# Altium schematic sheet Relay.SchDoc
size A4; SheetNumber: 11; SheetTotal: 11
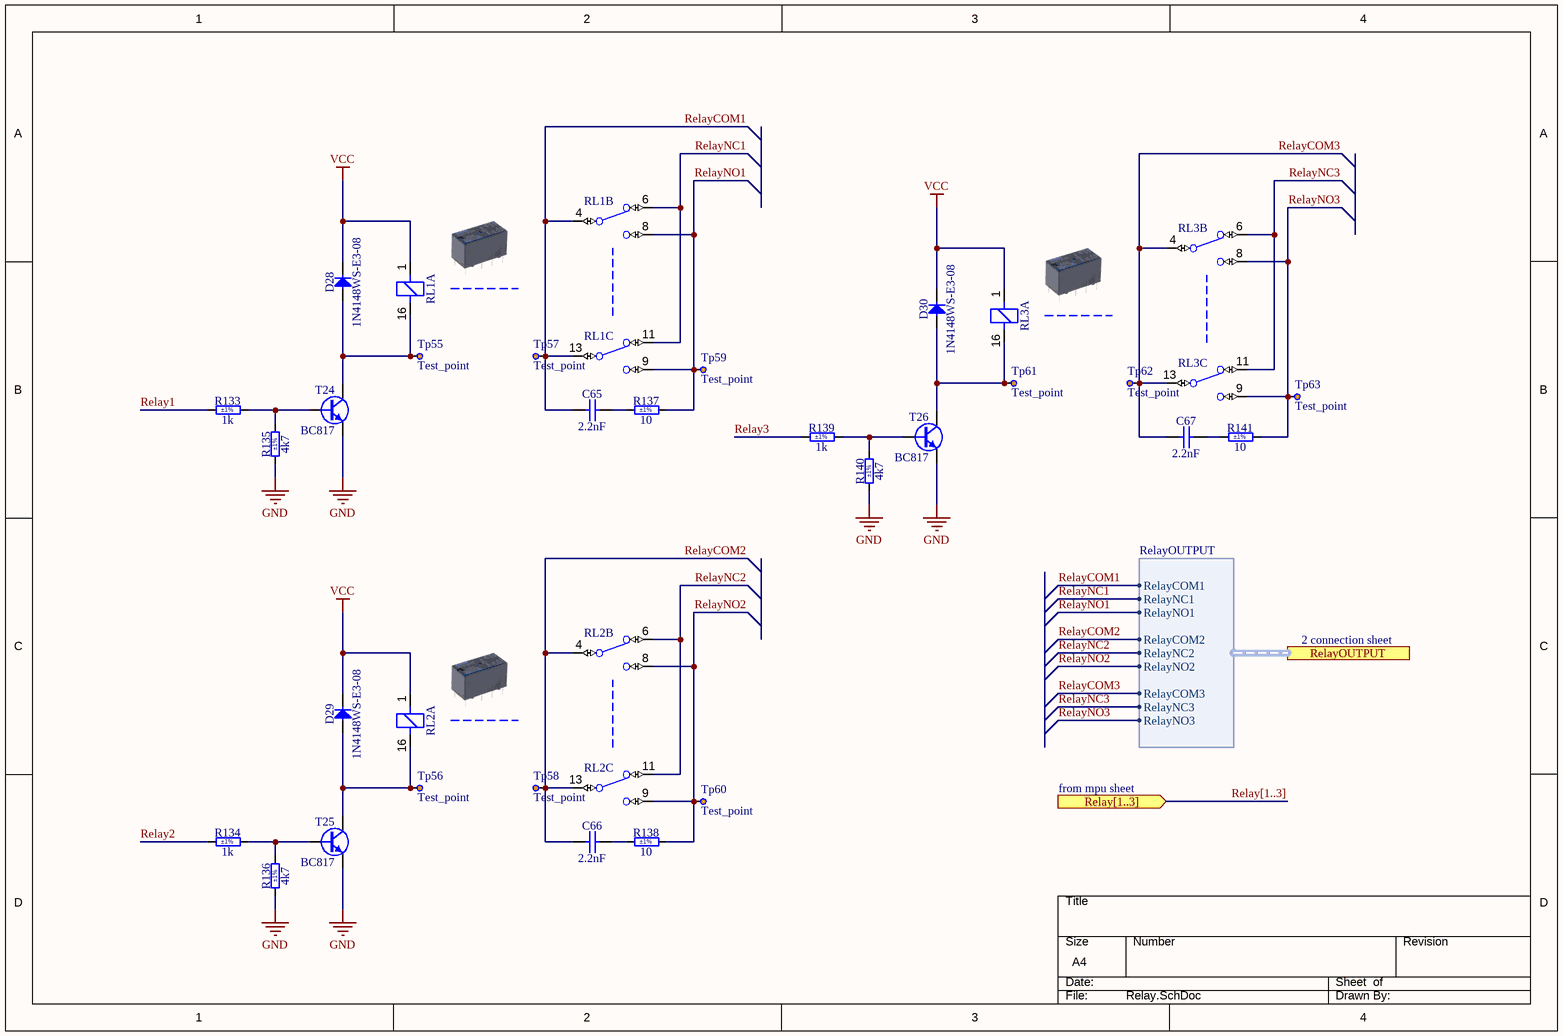
[diagram p0: Relay.SchDoc]

## Parts
C65  2.2nF  [CAPRB_MURATA_DE2E3KY222MA2BM01F]
C66  2.2nF  [CAPRB_MURATA_DE2E3KY222MA2BM01F]
C67  2.2nF  [CAPRB_MURATA_DE2E3KY222MA2BM01F]
D28  1N4148WS-E3-08  [SOD2713X115N]
D29  1N4148WS-E3-08  [SOD2713X115N]
D30  1N4148WS-E3-08  [SOD2713X115N]
R133  1k  Tolerance: ±1%  [RESC1608X55N]
R134  1k  Tolerance: ±1%  [RESC1608X55N]
R135  4k7  Tolerance: ±1%  [RESC1608X55N]
R136  4k7  Tolerance: ±1%  [RESC1608X55N]
R137  10  Tolerance: ±1%  [RESC3216X65N]
R138  10  Tolerance: ±1%  [RESC3216X65N]
R139  1k  Tolerance: ±1%  [RESC1608X55N]
R140  4k7  Tolerance: ±1%  [RESC1608X55N]
R141  10  Tolerance: ±1%  [RESC3216X65N]
RL1  REL_OMRON_G5V-2  [REL_OMRON_G5V-2]  (value not drawn)  (parts A,B,C of 3)
RL2  REL_OMRON_G5V-2  [REL_OMRON_G5V-2]  (value not drawn)  (parts A,B,C of 3)
RL3  REL_OMRON_G5V-2  [REL_OMRON_G5V-2]  (value not drawn)  (parts A,B,C of 3)
T24  BC817  [SOT95P230X110-3N]
T25  BC817  [SOT95P230X110-3N]
T26  BC817  [SOT95P230X110-3N]
Tp55  Test_point  [TP_C40]
Tp56  Test_point  [TP_C40]
Tp57  Test_point  [TP_C40]
Tp58  Test_point  [TP_C40]
Tp59  Test_point  [TP_C40]
Tp60  Test_point  [TP_C40]
Tp61  Test_point  [TP_C40]
Tp62  Test_point  [TP_C40]
Tp63  Test_point  [TP_C40]

## Ports
Relay[1..3] (in), RelayOUTPUT (harness RelayOUTPUT)

## Harnesses
RelayOUTPUT: RelayCOM1, RelayNC1, RelayNO1, RelayCOM2, RelayNC2, RelayNO2, RelayCOM3, RelayNC3, RelayNO3

## Nets
GND: R135.1 R136.1 R140.1 T24.2(E) T25.2(E) T26.2(E)
VCC: D28.1(C) D29.1(C) D30.1(C) RL1.1 RL2.1 RL3.1
Relay1: R133.1
Relay2: R134.1
Relay3: R139.1
RelayCOM1: C65.1 RL1.4(C) RL1.13(C) Tp57.1 ; port RelayOUTPUT.RelayCOM1
RelayCOM2: C66.1 RL2.4(C) RL2.13(C) Tp58.1 ; port RelayOUTPUT.RelayCOM2
RelayCOM3: C67.1 RL3.4(C) RL3.13(C) Tp62.1 ; port RelayOUTPUT.RelayCOM3
RelayNC1: RL1.6(NC) RL1.11(NC) ; port RelayOUTPUT.RelayNC1
RelayNC2: RL2.6(NC) RL2.11(NC) ; port RelayOUTPUT.RelayNC2
RelayNC3: RL3.6(NC) RL3.11(NC) ; port RelayOUTPUT.RelayNC3
RelayNO1: R137.2 RL1.8(NO) RL1.9(NO) Tp59.1 ; port RelayOUTPUT.RelayNO1
RelayNO2: R138.2 RL2.8(NO) RL2.9(NO) Tp60.1 ; port RelayOUTPUT.RelayNO2
RelayNO3: R141.2 RL3.8(NO) RL3.9(NO) Tp63.1 ; port RelayOUTPUT.RelayNO3
NetC65_2: C65.2 R137.1
NetC66_2: C66.2 R138.1
NetC67_2: C67.2 R141.1
NetD28_2: D28.2(A) RL1.16 T24.3(C) Tp55.1
NetD29_2: D29.2(A) RL2.16 T25.3(C) Tp56.1
NetD30_2: D30.2(A) RL3.16 T26.3(C) Tp61.1
NetR133_2: R133.2 R135.2 T24.1(B)
NetR134_2: R134.2 R136.2 T25.1(B)
NetR139_2: R139.2 R140.2 T26.1(B)

## Buses and harness runs
bus Relay[1..3] = port Relay[1..3]

## Notes on the sheet
- 2 connection sheet
- from mpu sheet

## Library data of the parts
C65-C67 = CCR_2.2NF_250V_20%_MURATA_DE2E3KY222MA2BM01F: Non-polarised capacitor; Part Description: Disc Ceramic Capacitors for General Purpose, Type KY (Basic Insulation) - Class X1 Y2; Manufacturer: MURATA; Voltage: 250VAC; Tolerance: ±20%; Part Number: CCR_2.2NF_250V_20%_MURATA_DE2E3KY222MA2BM01F; Component Kind: Standard; Component Type: Standard; Pin Count: 2; Value: 2.2nF; Status: None; Manufacturer Part Number: DE2E3KY222MA2BM01F; Case: LS5 W5 x D8; Mounted: Yes; Socket: No; SMD: No; Sense: No; ComponentHeight: 11mm; HelpURL: \\cern.ch\dfs\Applications\Altium\Datasheets\CCR_MURATA_DE2E3KY222MA2BM01F.pdf; Author: CERN DEM JLC; CreateDate: 17.09.2018; LatestRevisionDate: 17.09.2018
D28-D30 = 1N4148WS-E3-08: Diode; Part Description: Small Signal Fast Switching Diode; Manufacturer: VISHAY SEMICONDUCTORS; Voltage: 75V; Power: 150mA; PressFit: No; Bonding: No; Part Number: 1N4148WS-E3-08; Component Kind: Standard; Component Type: Standard; Device: 1N4148WS-E3-08; PackageDescription: SOD-323 Diode; 1.775mm W X 1.30mm L X 1.15mm H Body, IPC Medium Density; Manufacturer Part Number: 1N4148WS-E3-08; Pin Count: 3; Case: SOD-323; Mounted: Yes; Socket: No; SMD: Yes; Sense: No; ComponentHeight: 1.15mm; HelpURL: \\cern.ch\dfs\Applications\Altium\Datasheets\1N4148WS-E3-08.pdf; Author: CERN DEM JLC; CreateDate: 16.12.2013; LatestRevisionDate: 16.12.2013
R133 R134 R139 = R0603_1K_1%_0.1W_100PPM: Resistor - 1%; Part Description: General Purpose Thick Film Chip Resistor; Manufacturer: GENERIC; Manufacturer1 Part Number: NRC06F1001TRF; Power: 0.1W; TC: ±100ppm/°C; PressFit: No; Part Number: R0603_1K_1%_0.1W_100PPM; Component Kind: Standard; Component Type: Standard; Pin Count: 2; Value: 1k; Status: Preferred; Manufacturer Part Number: R0603_1K_1%_0.1W_100PPM; Case: 0603; Mounted: Yes; Sense: No; Socket: No; SMD: Yes; Manufacturer1 Example: NIC COMPONENT; Manufacturer1 ComponentHeight: 0.55mm; HelpURL: \\cern.ch\dfs\Applications\Altium\Datasheets\R0603_NIC_NRC.pdf; Author: CERN DEM JLC; CreateDate: 03.12.2007; LatestRevisionDate: 13.03.2008
R135 R136 R140 = R0603_4K7_1%_0.1W_100PPM: Resistor - 1%; Part Description: General Purpose Thick Film Chip Resistor; Manufacturer: GENERIC; Manufacturer1 Part Number: NRC06F4701TRF; Power: 0.1W; TC: ±100ppm/°C; PressFit: No; Part Number: R0603_4K7_1%_0.1W_100PPM; Component Kind: Standard; Component Type: Standard; Pin Count: 2; Value: 4k7; Status: Preferred; Manufacturer Part Number: R0603_4K7_1%_0.1W_100PPM; Case: 0603; Mounted: Yes; Sense: No; Socket: No; SMD: Yes; Manufacturer1 Example: NIC COMPONENT; Manufacturer1 ComponentHeight: 0.55mm; HelpURL: \\cern.ch\dfs\Applications\Altium\Datasheets\R0603_NIC_NRC.pdf; Author: CERN DEM JLC; CreateDate: 03.12.2007; LatestRevisionDate: 13.03.2008
R137 R138 R141 = R1206_10R_1%_0.25W_100PPM: Resistor - 1%; Part Description: General Purpose Thick Film Chip Resistor; Manufacturer: GENERIC; Manufacturer1 Part Number: NRC12F10R0TRF; Power: 0.25W; TC: ±100ppm/°C; PressFit: No; Part Number: R1206_10R_1%_0.25W_100PPM; Component Kind: Standard; Component Type: Standard; Pin Count: 2; Value: 10; Status: Preferred; Manufacturer Part Number: R1206_10R_1%_0.25W_100PPM; Case: 1206; Mounted: Yes; Sense: No; Socket: No; SMD: Yes; Manufacturer1 Example: NIC COMPONENT; Manufacturer1 ComponentHeight: 0.65mm; HelpURL: \\cern.ch\dfs\Applications\Altium\Datasheets\R1206_NIC_NRC.pdf; Author: CERN DEM BC; CreateDate: 14.12.2020; LatestRevisionDate: 14.12.2020
RL1-RL3 = REL_OMRON_G5V-2-H1 24VDC: Miniature Relay for Signal Circuits; Part Description: DPDT High Sensitivity Miniature Relay for Signal Circuits, G5V-2 Series; Manufacturer: OMRON ELECTRONIC; Manufacturer Part Number: G5V-2-H1 24DC; PressFit: No; Value: 24VDC; Part Number: REL_OMRON_G5V-2-H1 24VDC; Component Kind: Standard; Component Type: Standard; Pin Count: 8; PackageDescription: 8 Leads, Row Spacing 7.62mm; Body 20.5mm x 10.1mm, OMRON_G5V-2 Series; Mounted: Yes; Socket: No; SMD: No; Sense: No; Status: None; ComponentHeight: 11.5mm; HelpURL: \\cern.ch\dfs\Applications\Altium\Datasheets\REL_OMRON_G5V-2.pdf; Author: CERN DEM JLC; CreateDate: 23.09.2010; LatestRevisionDate: 23.09.2010
T24-T26 = BC817: NPN Transistor; Part Description: 45V 500mA NPN General-Purpose Transistor; Manufacturer: NXP SEMICONDUCTORS; PressFit: No; Bonding: No; Part Number: BC817; Component Kind: Standard; Component Type: Standard; Device: BC817; PackageDescription: SOT23, 0.95mm Pitch; 3 Pin, 1.30mm W X 2.90mm L X 1.10mm H body, IPC Medium Density; Manufacturer Part Number: BC817; Pin Count: 3; Case: SOT23-3; Mounted: Yes; Socket: No; SMD: Yes; Sense: No; ComponentHeight: 1.1mm; HelpURL: \\cern.ch\dfs\Applications\Altium\Datasheets\BC817.pdf; Author: CERN DEM JLC; CreateDate: 12.05.2011; LatestRevisionDate: 12.05.2011
Tp55-Tp63 = Test point: Published: 8-Jun-2000; LatestRevisionDate: 17-Jul-2002; LatestRevisionNote: Re-released for DXP Platform.; PackageReference: AXIAL-0.3; Publisher: Altium Limited